# EAGLE schematic 3pdt-breakout (EAGLE 9.6.2)
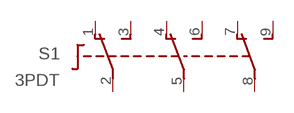
[diagram p0: schematic, sheet 1]

## Parts
S1  3PDT  [3PDT]
Unconnected: S1.1(O1) S1.2(P1) S1.3(S1) S1.4(O2) S1.5(P2) S1.6(S2) S1.7(O3) S1.8(P3) S1.9(S3)

## Library data of the parts
S1 = switch:3PDT: 3PDT 9 pin footswitch SF17020F-0302-21R-L Source: 3PDT.jpg